# Altium schematic sheet ARC-S-MOTOR.SchDoc
size A4
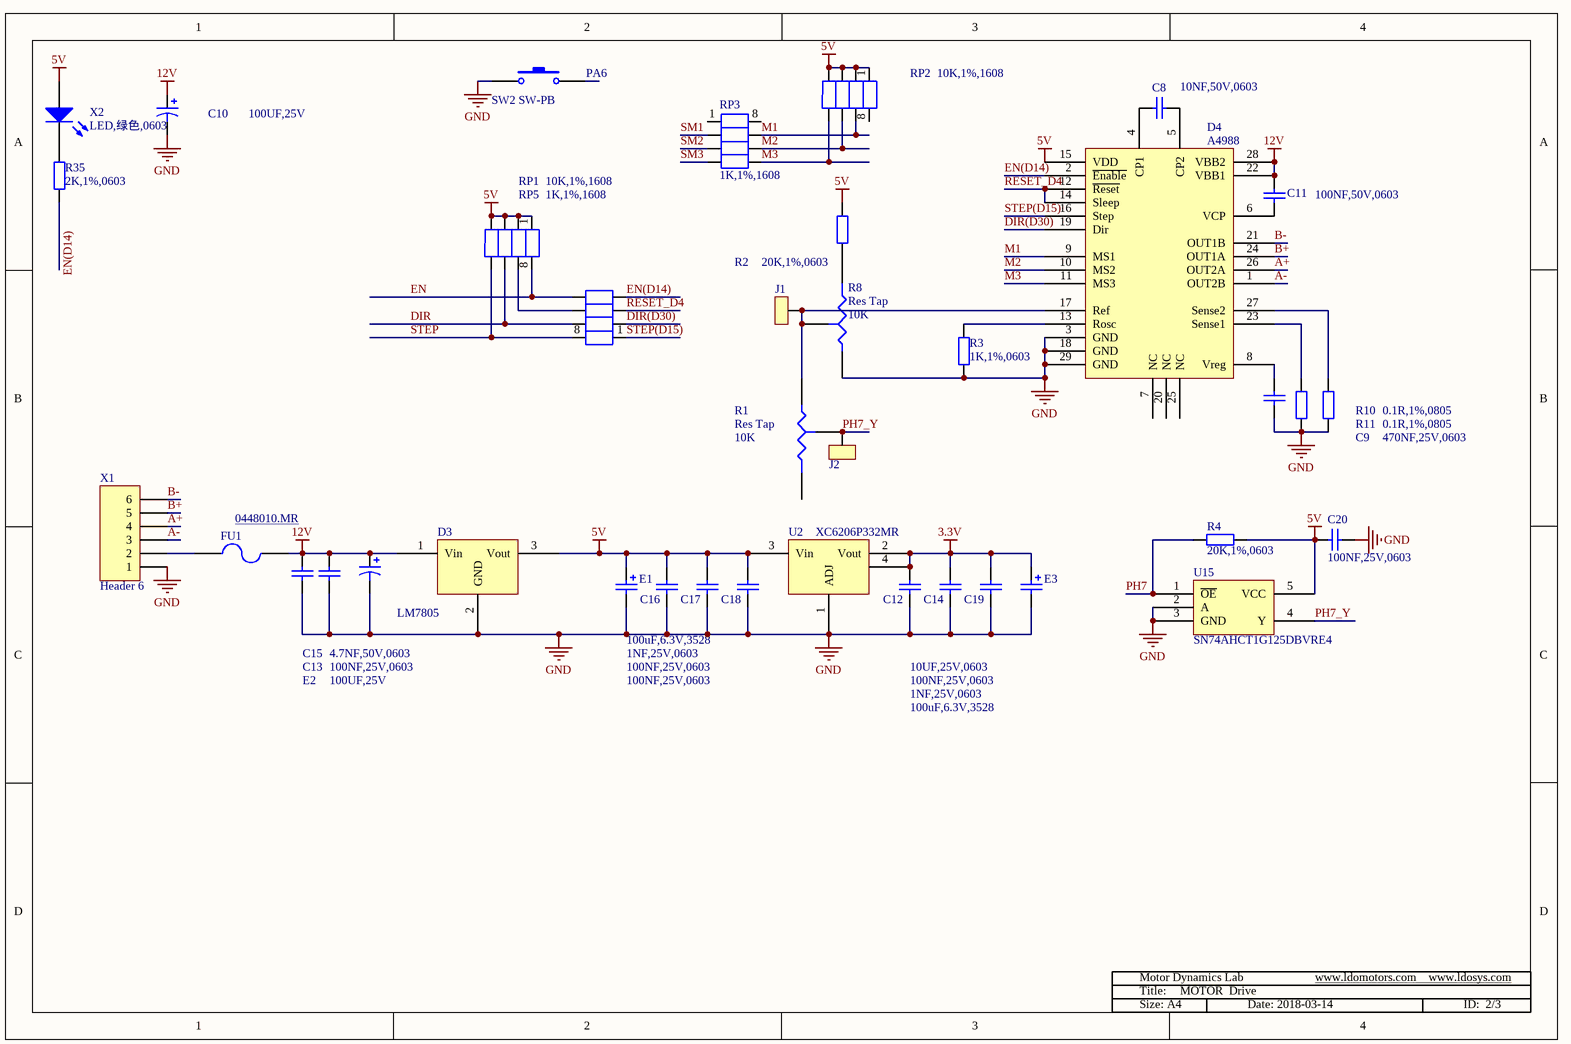
[diagram p0: ARC-S-MOTOR.SchDoc]

## Parts
C8  10NF,50V,0603  [RC0603]
C9  470NF,25V,0603  [RC0603]
C10  100UF,25V  [EC-5X5.3]
C11  100NF,50V,0603  [RC0603]
C12  100NF,25V,0603  [RC0603]
C13  100NF,25V,0603  [RC0603]
C14  10UF,25V,0603  [RC0603]
C15  4.7NF,50V,0603  [RC0603]
C16  1NF,25V,0603  [RC0603]
C17  100NF,25V,0603  [RC0603]
C18  100NF,25V,0603  [RC0603]
C19  1NF,25V,0603  [RC0603]
C20  100NF,25V,0603  [RC0603]
D3  LM7805  [78MXX]
D4  A4988  [QFN-28-M]
E1  100uF,6.3V,3528  [3528-21]
E2  100UF,25V  [EC-5X5.3]
E3  value 100uF,6.3V,3528  [3528-21]
FU1  0448010.MR
J1  测试点  [test]  (value not drawn)
J2  测试点  [test]  (value not drawn)
R1  Res Tap  value 10K
R2  20K,1%,0603  [RC0603]
R3  1K,1%,0603  [RC0603]
R4  20K,1%,0603  [RC0603]
R8  Res Tap  value 10K
R10  0.1R,1%,0805  [RC0805]
R11  0.1R,1%,0805  [RC0805]
R35  2K,1%,0603  [RC0603]
RP1  10K,1%,1608  [RP1608]
RP2  10K,1%,1608  [RP1608]
RP3  1K,1%,1608  [RP1608]
RP5  1K,1%,1608  [RP1608]
SW2  SW-PB  [SW-180]
U2  XC6206P332MR  [SOT-23]
U15  SN74AHCT1G125DBVRE4  [SOT-23-5]
X1  Header 6  [DIP-6-2.5]
X2  LED,绿色,0603  [LED-0603]

## Nets
3.3V: C12.2 C14.2 C19.2 E3.1 U2.2(Vout) U2.4
5V: C16.2 C17.2 C18.2 C20.1 D3.3(Vout) D4.15(VDD) E1.1 R2.1 R4.2 RP1.1 RP1.2 RP1.3 RP1.4 RP2.1 RP2.2 RP2.3 RP2.4 U2.3(Vin) U15.5(VCC) X2.1(A)
12V: C10.1 C11.2 C13.1 C15.2 D3.1(Vin) D4.22(VBB1) D4.28(VBB2) E2.1 FU1.2
GND: C9.1 C10.2 C12.1 C13.2 C14.1 C15.1 C16.1 C17.1 C18.1 C19.1 C20.2 D3.2(GND) D4.3(GND) D4.18(GND) D4.29(GND) E1.2 E2.2 E3.2 R3.1 R8.1(A) R10.1 R11.1 SW2.1 U2.1(ADJ) U15.2(A) U15.3(GND) X1.1
A+: D4.26(OUT2A) X1.4
A-: D4.1(OUT2B) X1.3
B+: D4.24(OUT1A) X1.5
B-: D4.21(OUT1B) X1.6
DIR: RP1.6 RP5.7
DIR(D30): D4.19(Dir) RP5.2
EN: RP1.8 RP5.5
EN(D14): D4.2(~{Enable}) R35.1 RP5.4
M1: D4.9(MS1) RP2.7 RP3.7
M2: D4.10(MS2) RP2.6 RP3.6
M3: D4.11(MS3) RP2.5 RP3.5
PA6: SW2.2
PH7: R4.1 U15.1(~{OE})
PH7_Y: J2.1 R1.3(TAP) U15.4(Y)
RESET_D4: D4.12(~{Reset}) D4.14(Sleep) RP5.3
SM1: RP3.2
SM2: RP3.3
SM3: RP3.4
STEP: RP1.5 RP5.8
STEP(D15): D4.16(Step) RP5.1
NetC8_1: C8.1 D4.4(CP1)
NetC8_2: C8.2 D4.5(CP2)
NetC9_2: C9.2 D4.8(Vreg)
NetC11_1: C11.1 D4.6(VCP)
NetD4_13: D4.13(Rosc) R3.2
NetD4_17: D4.17(Ref) J1.1 R1.1(A) R8.3(TAP)
NetD4_23: D4.23(Sense1) R10.2
NetD4_27: D4.27(Sense2) R11.2
NetFU1_1: FU1.1 X1.2
NetR2_2: R2.2 R8.2(B)
NetR35_2: R35.2 X2.2(K)
NetRP1_7: RP1.7 RP5.6

Not connected (* = marked no-connect by the designer): D4 7(NC) 20(NC) 25(NC); R1 2(B); RP2 8; RP3 1 8

## Notes on the sheet
- Motor Dynamics Lab
- Title:
- MOTOR  Drive
- www.ldomotors.com    www.ldosys.com
- Size: A4
- Date: 2018-03-14
- ID:  2/3

## Library data of the parts
C8 C9 C11-C20 = Cap: Capacitor; Value: 100pF; Published: 8-Jun-2000; LatestRevisionDate: 17-Jul-2002; LatestRevisionNote: Re-released for DXP Platform.; PackageReference: RAD-0.3; Publisher: Altium Limited; PackageDescription: Radial Cap, Thru-Hole; 2 Leads; 0.3 in Pin Spacing
C10 E2 = Cap Pol3: Polarized Capacitor (Surface Mount); Value: 100pF; Published: 8-Jun-2000; LatestRevisionDate: 29-May-2009; LatestRevisionNote: IPC-7351 Footprint Added.; PackageReference: C0805; Publisher: Altium Limited; PackageDescription: Chip Capacitor
D3 = LM78XX
E1 E3 = Cap Pol2: Polarized Capacitor (Axial); Published: 8-Jun-2000; LatestRevisionDate: 17-Jul-2002; LatestRevisionNote: Re-released for DXP Platform.; PackageReference: POLAR0.8; Publisher: Altium Limited; PackageDescription: Polarized Capacitor; 2 Leads
  E1: Value: 100uF,6.3V,3528
FU1 = Fuse 2: Fuse; Published: 8-Jun-2000; LatestRevisionDate: 17-Jul-2002; LatestRevisionNote: Re-released for DXP Platform.; PackageReference: PIN-W2/E2.8; Publisher: Altium Limited; PackageDescription: Thru-Hole; 2 Leads
R1 R8 = Res Tap: Tapped Resistor; Sim Note: Enter the Resistance value and the set point into parameter fields.; Set Position: 0.5; Published: 24-Mar-1999; LatestRevisionDate: 17-Jul-2002; LatestRevisionNote: Re-released for DXP Platform.; PackageReference: VR3; Publisher: Altium Limited; PackageDescription: Variable Resistor, Thru-Hole; 3 Leads
R2 R4 R10 R11 R35 = Res2: Resistor; Value: 1K; Published: 8-Jun-2000; LatestRevisionDate: 17-Jul-2002; LatestRevisionNote: Re-released for DXP Platform.; PackageReference: AXIAL-0.4; Publisher: Altium Limited; PackageDescription: Axial Device, Thru-Hole; 2 Leads; 0.4 in Pin Spacing
R3 = Res2: Resistor; Published: 8-Jun-2000; LatestRevisionDate: 17-Jul-2002; LatestRevisionNote: Re-released for DXP Platform.; PackageReference: AXIAL-0.4; Publisher: Altium Limited; PackageDescription: Axial Device, Thru-Hole; 2 Leads; 0.4 in Pin Spacing; Value: 1K
RP1-RP3 RP5 = RP1608-1
SW2 = SW-PB: Switch; Published: 24-Mar-1999; LatestRevisionDate: 17-Jul-2002; LatestRevisionNote: Re-released for DXP Platform.; PackageReference: SPST-2; Publisher: Altium Limited; PackageDescription: Switch; 2 Leads
U2 = AMS1117-3.3
U15 = 74AHCT1G125
X1 = Header 6: Header, 6-Pin; LatestRevisionDate: 17-Jul-2002; LatestRevisionNote: Re-released for DXP Platform.; Publisher: Altium Limited
X2 = LED0: Typical INFRARED GaAs LED; Published: 8-Jun-2000; LatestRevisionDate: 08-Jul-2005; LatestRevisionNote: Mech Layer 1 removed.; PackageReference: LED-0; Publisher: Altium Limited; PackageDescription: LED; 2 Leads